# Altium schematic sheet Inverter Circuit.SchDoc
size A4; SheetNumber: 2; SheetTotal: 3
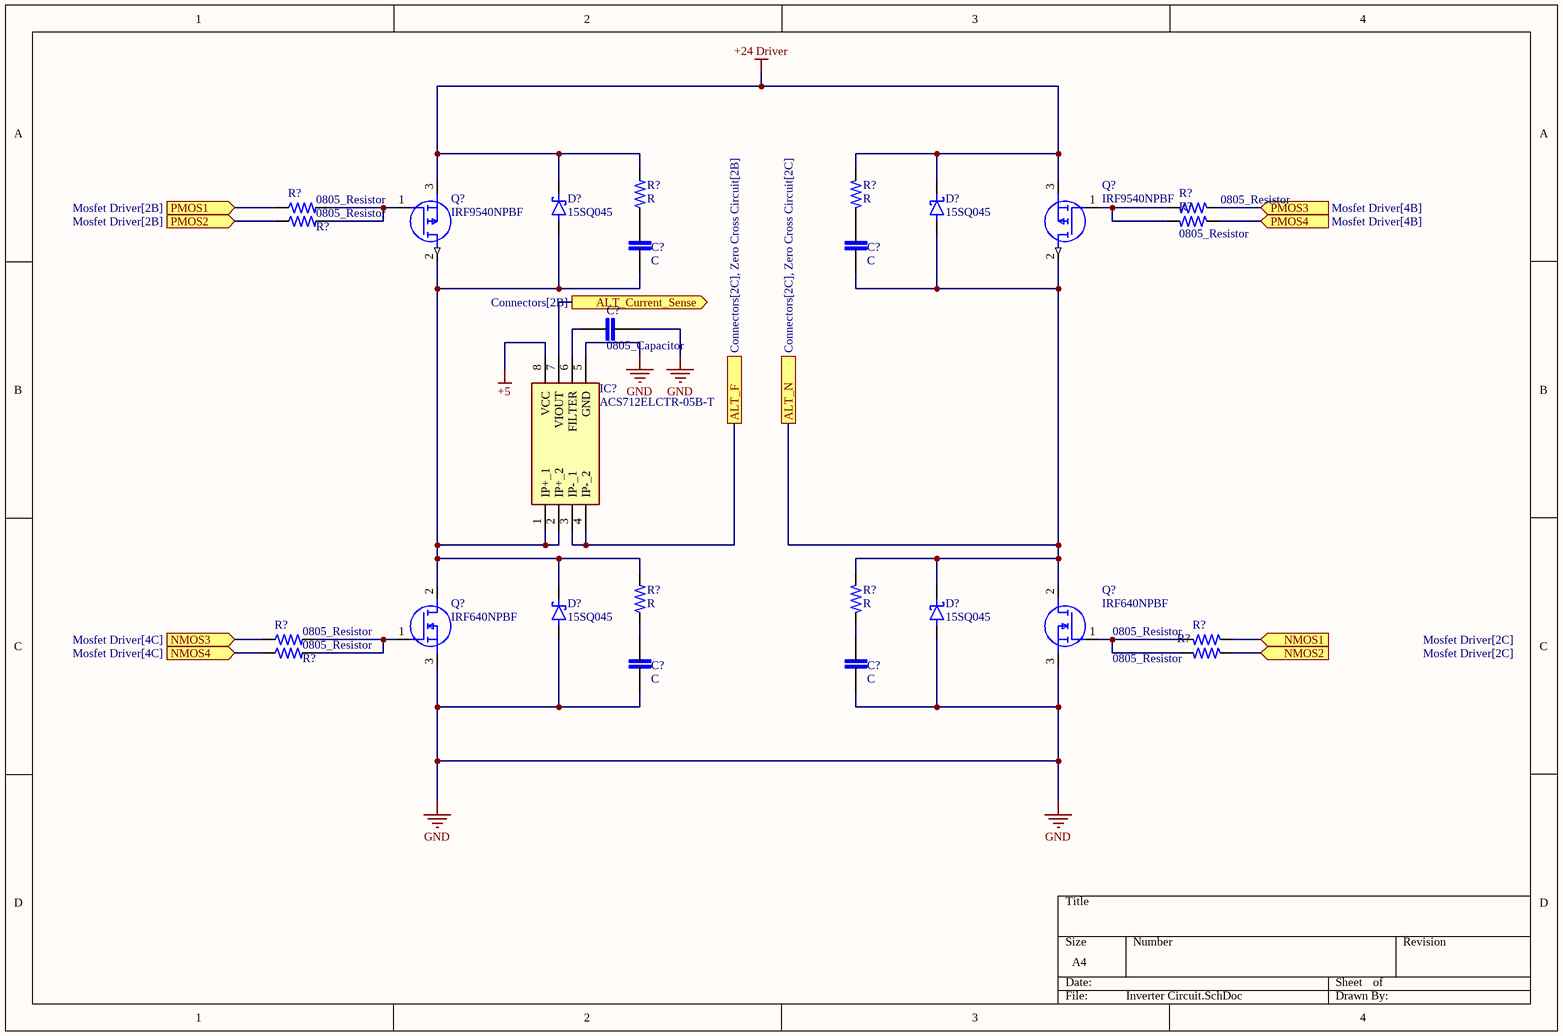
[diagram p0: Inverter Circuit.SchDoc]

## Parts
(Parts that share a designator on the sheet are numbered #1, #2 ... from top to bottom, then left to right.)
C?#1  C  [0805]
C?#2  C  [0805]
C?#3  0805_Capacitor  [0805]
C?#4  C  [0805]
C?#5  C  [0805]
D?#1  15SQ045  [Common Trhough Hole]
D?#2  15SQ045  [Common Trhough Hole]
D?#3  15SQ045  [Common Trhough Hole]
D?#4  15SQ045  [Common Trhough Hole]
IC?  ACS712ELCTR-05B-T  [SOIC127P600X175-8N]
Q?#1  IRF9540NPBF  [TO254P469X1042X1967-3P]
Q?#2  IRF9540NPBF  [TO254P469X1042X1967-3P]
Q?#3  IRF640NPBF  [TO254P483X1016X1994-3P]
Q?#4  IRF640NPBF  [TO254P483X1016X1994-3P]
R?#1  R  [0805]
R?#2  R  [0805]
R?#3  0805_Resistor  [0805]
R?#4  0805_Resistor  [0805]
R?#5  0805_Resistor  [0805]
R?#6  0805_Resistor  [0805]
R?#7  R  [0805]
R?#8  R  [0805]
R?#9  0805_Resistor  [0805]
R?#10  0805_Resistor  [0805]
R?#11  0805_Resistor  [0805]
R?#12  0805_Resistor  [0805]

## Ports
ALT_Current_Sense (out, see Connectors[2B]), ALT_F (see Connectors[2C], Zero Cross Circuit[2B]), ALT_N (see Connectors[2C], Zero Cross Circuit[2C]), NMOS1 (in, see Mosfet Driver[2C]), NMOS2 (in, see Mosfet Driver[2C]), NMOS3 (in, see Mosfet Driver[4C]), NMOS4 (in, see Mosfet Driver[4C]), PMOS1 (in, see Mosfet Driver[2B]), PMOS2 (in, see Mosfet Driver[2B]), PMOS3 (in, see Mosfet Driver[4B]), PMOS4 (in, see Mosfet Driver[4B])

## Nets
+5: IC?.8(VCC)
+24 Driver: D?#1.1(K) D?#2.1(K) Q?#1.3(S) Q?#2.3(S) R?#1.2 R?#2.2
GND: C?#3.2 C?#4.2 C?#5.2 D?#3.2(A) D?#4.2(A) IC?.5(GND) Q?#3.3(S) Q?#4.3(S)
ALT_Current_Sense: IC?.7(VIOUT) ; port ALT_Current_Sense
ALT_F: IC?.3(IP-_1) IC?.4(IP-_2) ; port ALT_F
ALT_N: C?#2.2 D?#2.2(A) D?#4.1(K) Q?#2.2(D) Q?#4.2(D) R?#8.2 ; port ALT_N
NMOS1: R?#10.1 ; port NMOS1
NMOS2: R?#12.1 ; port NMOS2
NMOS3: R?#9.1 ; port NMOS3
NMOS4: R?#11.1 ; port NMOS4
PMOS1: R?#3.1 ; port PMOS1
PMOS2: R?#5.1 ; port PMOS2
PMOS3: R?#4.1 ; port PMOS3
PMOS4: R?#6.1 ; port PMOS4
NetC?#1_2: C?#1.2 D?#1.2(A) D?#3.1(K) IC?.1(IP+_1) IC?.2(IP+_2) Q?#1.2(D) Q?#3.2(D) R?#7.2
NetC?#3_1: C?#3.1 IC?.6(FILTER)
NetC?#4_1: C?#4.1 R?#7.1
NetC?#5_1: C?#5.1 R?#8.1
NetQ?#1_1: Q?#1.1(G) R?#3.2 R?#5.2
NetQ?#2_1: Q?#2.1(G) R?#4.2 R?#6.2
NetQ?#3_1: Q?#3.1(G) R?#9.2 R?#11.2
NetQ?#4_1: Q?#4.1(G) R?#10.2 R?#12.2

Not connected (* = marked no-connect by the designer): C?#1 1; C?#2 1; R?#1 1; R?#2 1

## Library data of the parts
C?#1-C?#5 = 0805_Capacitor: MP: LD051A121KAB2A; MF: AVX; SnapEDA_Link: https://www.snapeda.com/parts/LD051A121KAB2A/AVX/view-part/?ref=snap; Package: 0805 AVX; Check_prices: https://www.snapeda.com/parts/LD051A121KAB2A/AVX/view-part/?ref=eda; Purchase-URL: https://pricing.snapeda.com/search/part/LD051A121KAB2A/?ref=eda; Price: None; Value: *; Availability: In Stock
D?#1-D?#4 = Schottky Diode: MF: Diodes Inc.; MP: 1N5817-T; Package: DO-41 Diodes Inc.; Price: None; Check_prices: https://www.snapeda.com/parts/1N5817-T/Diodes+Inc./view-part/?ref=eda; Value: *; SnapEDA_Link: https://www.snapeda.com/parts/1N5817-T/Diodes+Inc./view-part/?ref=snap; Availability: In Stock; Purchase-URL: https://pricing.snapeda.com/search/part/1N5817-T/?ref=eda
IC? = ACS712ELCTR-05B-T: Integrated Circuit; Manufacturer_Name: Sharp Microelectronics; Datasheet Link: https://www.allegromicro.com/~/media/Files/Datasheets/ACS712-Datasheet.ashx; Height: 1.75mm; Manufacturer_Part_Number: ACS712ELCTR-05B-T
Q?#1 Q?#2 = IRF9540NPBF: MOSFET (P-Channel); Manufacturer_Name: Infineon; Datasheet Link: https://www.infineon.com/dgdl/irf9540npbf.pdf?fileId=5546d462533600a401535611cfa21dc8; Height: 4.69mm; Manufacturer_Part_Number: IRF9540NPBF; Mouser Part Number: 942-IRF9540NPBF; Mouser Price/Stock: https://www.mouser.co.uk/ProductDetail/Infineon-Technologies/IRF9540NPBF?qs=9%252BKlkBgLFf0vnuA8mxUPtw%3D%3D; Arrow Part Number: IRF9540NPBF; Arrow Price/Stock: https://www.arrow.com/en/products/irf9540npbf/infineon-technologies-ag?region=europe
Q?#3 Q?#4 = IRF640NPBF: MOSFET (N-Channel); Manufacturer_Name: Infineon; Datasheet Link: https://www.infineon.com/dgdl/Infineon-IRF640N-DataSheet-v01_01-EN.pdf?fileId=5546d462533600a4015355e7be9019ee; Height: 4.83mm; Manufacturer_Part_Number: IRF640NPBF; Mouser Part Number: 942-IRF640NPBF; Mouser Price/Stock: https://www.mouser.co.uk/ProductDetail/Infineon-Technologies/IRF640NPBF?qs=9%252BKlkBgLFf3E8kFH1ru13w%3D%3D; Arrow Part Number: IRF640NPBF; Arrow Price/Stock: https://www.arrow.com/en/products/irf640npbf/infineon-technologies-ag?region=europe
R?#1-R?#12 = 0805_Resistor: Power_Rating: .25 W; MP: 2-2176053-0; Tolerance: 1%; Resistance: .33; MF: TE Connectivity; Price: None; Availability: In Stock; EU_RoHS_Compliance: Compliant with Exemptions; Package: 0805; Value: *; SnapEDA_Link: https://www.snapeda.com/parts/2-2176053-0/TE+Connectivity/view-part/?ref=snap; Check_prices: https://www.snapeda.com/parts/2-2176053-0/TE+Connectivity/view-part/?ref=eda